# Altium project MainFCC_PCB.PrjPcb (part 1 of 2)
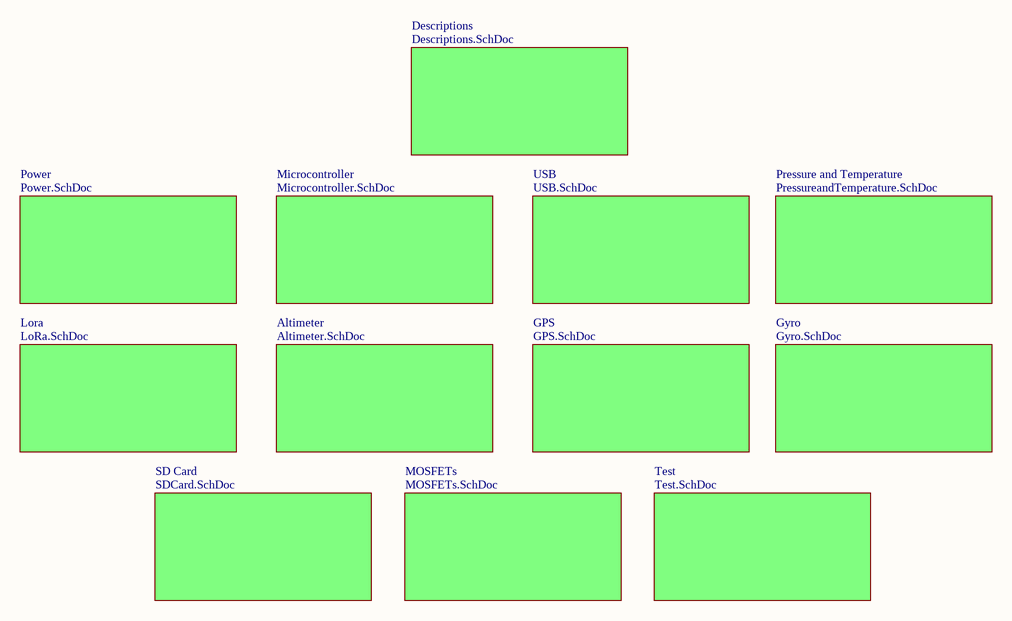
[diagram p0: Main.SchDoc]
Address1: SCÜ; Address2: Merkez     /; Address3: Sivas; Address4: Türkiye; CompanyName: Alpina Rocket; DocumentNumber: 0001; DrawnBy: Av. Des. Tm.; Organization: Alpina Rocket; Revision: v1.0.0
13 sheets, 119 parts. Net scope: flat (ports and power ports of the same name join across sheets).
Board file: MainFCC_PCBBoard.PcbDoc
Sheets:
  Main.SchDoc
    Power = Power.SchDoc
    Microcontroller = Microcontroller.SchDoc
    USB = USB.SchDoc
    Pressure and Temperature = PressureandTemperature.SchDoc
    Gyro = Gyro.SchDoc
    GPS = GPS.SchDoc
    Altimeter = Altimeter.SchDoc
    Lora = LoRa.SchDoc
    Test = Test.SchDoc
    MOSFETs = MOSFETs.SchDoc
    Descriptions = Descriptions.SchDoc
    SD Card = SDCard.SchDoc

## Sheet Main.SchDoc
size A4; SheetNumber: 1; SheetTotal: 13

### Sub-sheets
Altimeter = Altimeter.SchDoc: no entries
Descriptions = Descriptions.SchDoc: no entries
GPS = GPS.SchDoc: no entries
Gyro = Gyro.SchDoc: no entries
Lora = LoRa.SchDoc: no entries
Microcontroller = Microcontroller.SchDoc: no entries
MOSFETs = MOSFETs.SchDoc: no entries
Power = Power.SchDoc: no entries
Pressure and Temperature = PressureandTemperature.SchDoc: no entries
SD Card = SDCard.SchDoc: no entries
Test = Test.SchDoc: no entries
USB = USB.SchDoc: no entries

### Notes on the sheet
- Title:
- Size:
- Date:
- A4
- Number:
- Time:
- Revision:
- Sheet
- of
- Project
- Drawn By :

## Sheet Power.SchDoc: Power Distribution
size A4; ApprovedBy: Ayçin Erbil, Ayşe Hazal Demirci, Büşra Yılmaz, Ekrem Turan Fırat, Fatmanur Özen, Meryem Şen; CheckedBy: Ayçin Erbil, Ayşe Hazal Demirci, Büşra Yılmaz, Ekrem Turan Fırat, Fatmanur Özen, Meryem Şen; Author: Ayçin Erbil, Ayşe Hazal Demirci, Büşra Yılmaz, Ekrem Turan Fırat, Fatmanur Özen, Meryem Şen; CompanyName: Alpina Roket; DrawnBy: Av. Des. Tm.; Engineer: Ayçin Erbil, Ayşe Hazal Demirci, Büşra Yılmaz, Ekrem Turan Fırat, Fatmanur Özen, Meryem Şen; Organization: Alpina Roket; Address1: SCÜ; Address2: Merkez   /; Address3: Sivas; Address4: Türkiye; DocumentNumber: 0001; Revision: v0.0.1; SheetNumber: 3; SheetTotal: 13
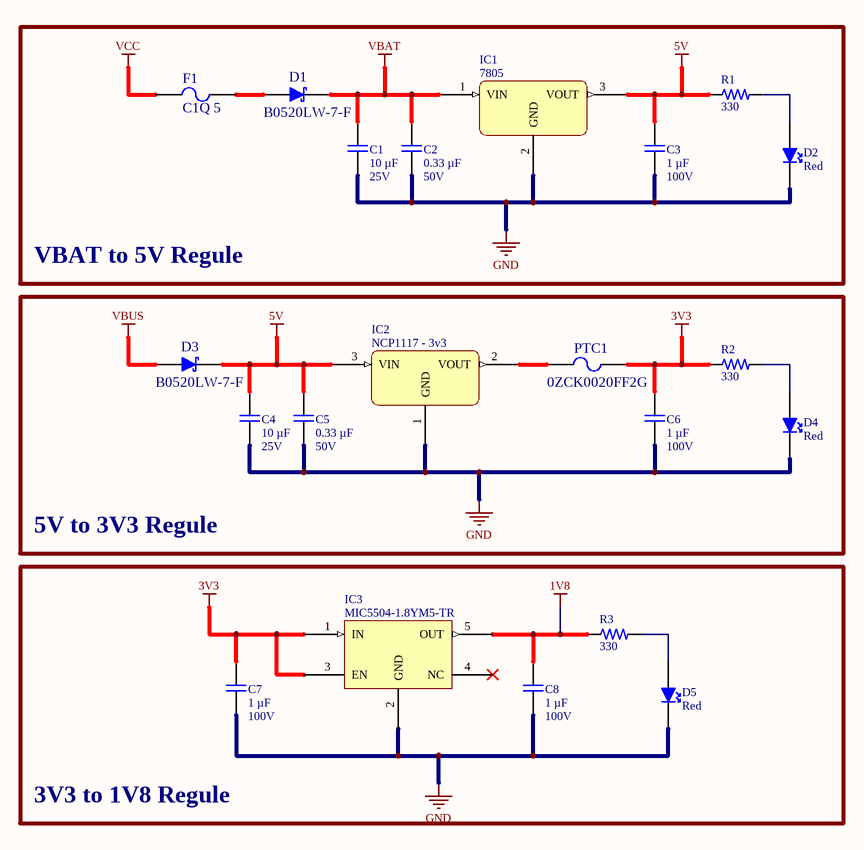
[diagram p1: Power.SchDoc]

### Parts
C1  10 µF  Voltage Rating: 25V  [MergenElektronik_Capacitors_Ceramics_SMDs_0603_L_NS]
C2  0.33 µF  Voltage Rating: 50V  [MergenElektronik_Capacitors_Ceramics_SMDs_0603_L_NS]
C3  1 µF  Voltage Rating: 100V  [MergenElektronik_Capacitors_Ceramics_SMDs_1206_M_NS]
C4  10 µF  Voltage Rating: 25V  [MergenElektronik_Capacitors_Ceramics_SMDs_0603_M_NS]
C5  0.33 µF  Voltage Rating: 50V  [MergenElektronik_Capacitors_Ceramics_SMDs_0603_M_NS]
C6  1 µF  Voltage Rating: 100V  [MergenElektronik_Capacitors_Ceramics_SMDs_1206_M_NS]
C7  1 µF  Voltage Rating: 100V  [MergenElektronik_Capacitors_Ceramics_SMDs_1206_M_NS]
C8  1 µF  Voltage Rating: 100V  [MergenElektronik_Capacitors_Ceramics_SMDs_1206_M_NS]
D1  B0520LW-7-F  [MergenElektronik_Diodes_SchottkyDiodes_SOD-523]
D2  Red  [MergenElektronik_Leds_SMDs_0603_M_NS]
D3  B0520LW-7-F  [MergenElektronik_Diodes_SchottkyDiodes_SOD-523]
D4  Red  [MergenElektronik_Leds_SMDs_0603_M_NS]
D5  Red  [MergenElektronik_Leds_SMDs_0603_M_NS]
F1  C1Q 5  [MergenElektronik_CircuitProtections_Fuses_1206_l]
IC1  7805  [MergenElektronik_Regulators_Linears_DPAK]
IC2  NCP1117 - 3v3  [MergenElektronik_Regulators_Linears_SOT223]
IC3  MIC5504-1.8YM5-TR  [MergenElektronik_Regulators_Linears_SOT-23-5]
PTC1  0ZCK0020FF2G  [MergenElektronik_CircuitProtections_PTCs_0805_M_NS]
R1  330  [MergenElektronik_Resistors_ChipResistors_0603_M_NS]
R2  330  [MergenElektronik_Resistors_ChipResistors_0603_M_NS]
R3  330  [MergenElektronik_Resistors_ChipResistors_0603_M_NS]

### Blocks framed on the sheet
VBAT to 5V Regule: C1-C3 D1 D2 F1 IC1 R1
5V to 3V3 Regule: C4-C6 D3 D4 IC2 PTC1 R2
3V3 to 1V8 Regule: C7 C8 D5 IC3 R3

### Nets
1V8: C8.1 IC3.5(OUT) R3.1
3V3: C6.1 C7.1 IC3.1(IN) IC3.3(EN) PTC1.2 R2.1
5V: C3.1 C4.1 C5.1 D3.2(KATOT) IC1.3(VOUT) IC2.3(VIN) R1.1
GND: C1.2 C2.2 C3.2 C4.2 C5.2 C6.2 C7.2 C8.2 D2.2(KATOT) D4.2(KATOT) D5.2(KATOT) IC1.2(GND) IC2.1(GND) IC3.2(GND)
VBAT: C1.1 C2.1 D1.2(KATOT) IC1.1(VIN)
VBUS: D3.1(ANOT)
VCC: F1.1
NetD1_1: D1.1(ANOT) F1.2
NetD2_1: D2.1(ANOT) R1.2
NetD4_1: D4.1(ANOT) R2.2
NetD5_1: D5.1(ANOT) R3.2
NetIC2_2: IC2.2(VOUT) PTC1.1

Not connected (* = marked no-connect by the designer): IC3 4(NC)*

### Notes on the sheet
- Title:
- Size:
- Date:
- A4
- Number:
- Time:
- Revision:
- Sheet
- of
- Project
- Drawn By :

### Library data of the parts
C1 C4 = MergenElektronik_Capacitors_Ceramic_SMDs_10µF_25V: Mergen Elektronik - Capacitors - Ceramics - SMDs - 0603 - 10 µF - 25V; Manufacturer: Murata Electronics; Manufacturer Number: GRT188R61E106ME13D; Model: Ceramic Capacitors; Tolerance: ±20%; Value: 10 µF; Temperature: -55°C up to +85°C; Digi-Key Number: 490-12323-1-ND; Package: 0603(1608); Farnell Number: 3581819; Mouser Number: 81-GRT188R61E106ME3D; Mounting Type: Surface Mount; Supplier 1: Digi-Key; Supplier 2: Mouser; Supplier Part Number 1: 490-12323-1-ND; Supplier Part Number 2: 81-GRT188R61E106ME3D
C2 C5 = MergenElektronik_Capacitors_Ceramic_SMDs_0.33µF_50V: Mergen Elektronik - Capacitors - Ceramics - SMDs - 0603 - 0.33 µF - 50V; Manufacturer: TDK Corporation; Manufacturer Number: C1608X7R1H334K080AC; Model: Ceramic Capacitors; Tolerance: ±10%; Value: 0.33 µF; Temperature: -55°C up to +125°C; Digi-Key Number: 445-5950-1-ND; Package: 0603(1608); Farnell Number: 2346907; Mouser Number: 810-C1608X7R1H334K; Mounting Type: Surface Mount; Supplier 1: Digi-Key; Supplier 2: Mouser; Supplier Part Number 1: 445-5950-1-ND; Supplier Part Number 2: 810-C1608X7R1H334K
C3 C6-C8 = MergenElektronik_Capacitors_Ceramic_SMDs_1µF_100V: Mergen Elektronik - Capacitors - Ceramics - SMDs - 1206 - 1 µF - 100V; Manufacturer: Samsung Electro-Mechanics; Manufacturer Number: CL31B105KCHNNNE; Model: Ceramic Capacitors; Tolerance: ±10%; Value: 1 µF; Temperature: -55°C up to +125°C; Digi-Key Number: 1276-1838-1-ND; Package: 1206(3216 Metric); Mouser Number: 187-CL31B105KCHNNNE; Mounting Type: Surface Mount; Özdisan Number: CL31B105KCHNNNE; Supplier 1: Digikey; Supplier 2: Mouser; Supplier Part Number 1: 1276-1838-1-ND; Supplier Part Number 2: 187-CL31B105KCHNNNE
D1 D3 = MergenElektronik_Diodes_SchottkyDiodes_B0520LW-7-F: Mergen Elektronik - Diodes - Schottky Diodes - B0520LW-7-F; Manufacturer: Diodes Incorporated; Breakdown Voltage: 20V; Current Rating: 500mA; Forward Voltage: 385 mV @ 500mA; Digi-Key Number: B0520LW-FDITR-ND; Manufacturer Number: B0520LW-7-F; Model: Schottky Diodes; Mounting Type: Surface Mount; Package: SOD-123; Temperature: -65°C up to +125°C; Value: B0520LW-7-F; Mouser Number: 621-B0520LW-F; Farnell Number: 1773476; Supplier 1: Digikey; Supplier 2: Mouser; Supplier Part Number 2: 621-B0520LW-F; Supplier Part Number 1: B0520LW-FDITR-ND
D2 D4 D5 = MergenElektronik_LEDs_SMDs_Red_0603: Mergen Elektronik - Leds - SMDs - Red - 0603; Manufacturer: Würth Elektronik; Manufacturer Number: 150060RS75000; Model: SMD Leds; Voltage Rating: 2V; Value: Red; Temperature: -45°C up to +85°C; Digi-Key Number: 732-4978-1-ND; Package: 0603(1608); Farnell Number: 2322071; Mouser Number: 710-150060RS75000; Mounting Type: Surface Mount; Color: Red; Özdisan Number: 150060RS75000; Supplier 1: Digi-Key; Supplier 2: Mouser; Supplier Part Number 1: 732-4978-1-ND; Supplier Part Number 2: 710-150060RS75000
F1 = MergenElektronik_CircuitProtections_Fuses_0C1Q 5: Mergen Elektronik - Circuit Protections - Fuses - 0C1Q 5; Manufacturer: Bel Fuse Inc.; Model: Fuse; Voltage Rating: 125V @ AC - 63V @ DC; Current Rating: 5 A; Breaking Capacity: 100A @ AC,- 50A @ DC; Melting I²t: 0.075; Response Time: Fast Blow; Digi-Key Number: 5923-C1Q5TR-ND; Manufacturer Number: C1Q 5; Mounting Type: Surface Mount; Mouser Number: 530-0ZCK0020FF2G; Package: 1206(3216); Temperature: -40°C up to 85°C; Value: C1Q 5; Supplier 1: Digi-Key; Supplier Part Number 1: 507-1811-6-ND
IC1 = MergenElektronik_Regulators_Linears_MC7805BDTG: Mergen Elektronik - Regulators - Linears - MC7805BDTG; Manufacturer: onsemi; Current Rating: 1A; Model: Linear; Output Voltage: 5V; Voltage Rating: 7VDC up to 36V; Temperature: -40°C up to +125°C; Value: MC7805BDTG; Mounting Type: Surface Mount; Digi-Key Number: MC7805BDTGOS-ND; Manufacturer Number: MC7805BDTG; Mouser Number: 863-MC7805BDTG; Özdisan Number: MC7805BDTG; Farnell Number: 1652336; Package: DPAK; Supplier 1: Digi-Key; Supplier 2: Mouser; Supplier Part Number 1: MC7805BDTGOS-ND; Supplier Part Number 2: 863-MC7805BDTG
IC2 = MergenElektronik_Regulators_Linears_NCP1117ST33T3G: Mergen Elektronik - Regulators - Linears - NCP1117ST33T3G; Manufacturer: onsemi; Current Rating: 1A; Model: Linear; Output Voltage: 3.3V; Voltage Rating: 4.75VDC up to 10V; Temperature: 0°C up to +125°C; Value: NCP1117ST33T3G; Mounting Type: Surface Mount; Digi-Key Number: NCP1117ST33T3GOSCT-ND; Manufacturer Number: NCP1117ST33T3G; Mouser Number: 863-NCP1117ST33T3G; Özdisan Number: NCP1117ST33T3G; Supplier 1: Digi-Key; Supplier 2: Mouser; Supplier Part Number 1: NCP1117ST33T3GOSCT-ND; Supplier Part Number 2: 863-NCP1117ST33T3G; Package: SOT-223
IC3 = MergenElektronik_Regulators_Linears_MIC5504-1.8YM5-TR: Mergen Elektronik - Regulators - Linears - MIC5504-1.8YM5-TR; Manufacturer: Microchip Technology; Current Rating: 300mA; Model: Linear; Output Voltage: 1.8V(Fixed); Voltage Rating: 2.2V up to 5.5V; Temperature: -40°C up to +125°C; Value: MIC5504-1.8YM5-TR; Mounting Type: Surface Mount; Digi-Key Number: 576-4879-2-ND; Manufacturer Number: MIC5504-1.8YM5-TR; Mouser Number: 998-MIC5504-1.8YM5TR; Farnell Number: 2809977; Package: SOT-23-5; Supplier 1: Digikey; Supplier 2: Mouser; Supplier Part Number 1: 576-4879-2-ND; Supplier Part Number 2: 998-MIC5504-1.8YM5TR
PTC1 = MergenElektronik_CircuitProtections_PTCs_0ZCK0020FF2G: Mergen Elektronik - Circuit Protections - PTCs - 0ZCK0020FF2G; Manufacturer: Bel Fuse Inc.; Model: PTC Fuse; Current Rating: 500 mA; Voltage Rating: 9V; Current - Max: 100A; Current - Hold: 200 mA; Digi-Key Number: 507-1811-1-ND; Manufacturer Number: 0ZCK0020FF2G; Mounting Type: Surface Mount; Mouser Number: 530-0ZCK0020FF2G; Package: 0805(2012); Temperature: -40°C up to 85°C; Value: 0ZCK0020FF2G; Supplier 1: Digi-Key; Supplier Part Number 1: 507-1811-6-ND; Current - Trip: 500 mA; Supplier 2: Mouser; Supplier Part Number 2: 530-0ZCK0020FF2G
R1-R3 = MergenElektronik_Resistors_ChipResistors_0603_330R: Mergen Elektronik - Resistors - Chip Resistors - 0603 - 330R; Manufacturer: Stackpole Electronics Inc; Manufacturer Number: RMCF0603JT330R; Value: Chip Resistor - 0603 - 330R; Power: 1/10W; Tolerance: ±5%; Package: 0603(1608); Temperature: -55°C up to +155°C - X8R; Model: Chip Resistor; Digi-Key Number: RMCF0603JT330RCT-ND; Mounting Type: Surface Mount; Supplier 1: Digi-Key; Supplier Part Number 1: RMCF0603JT330RCT-ND

## Sheet Microcontroller.SchDoc: Microcontroller
size A4; SheetNumber: 4; SheetTotal: 13
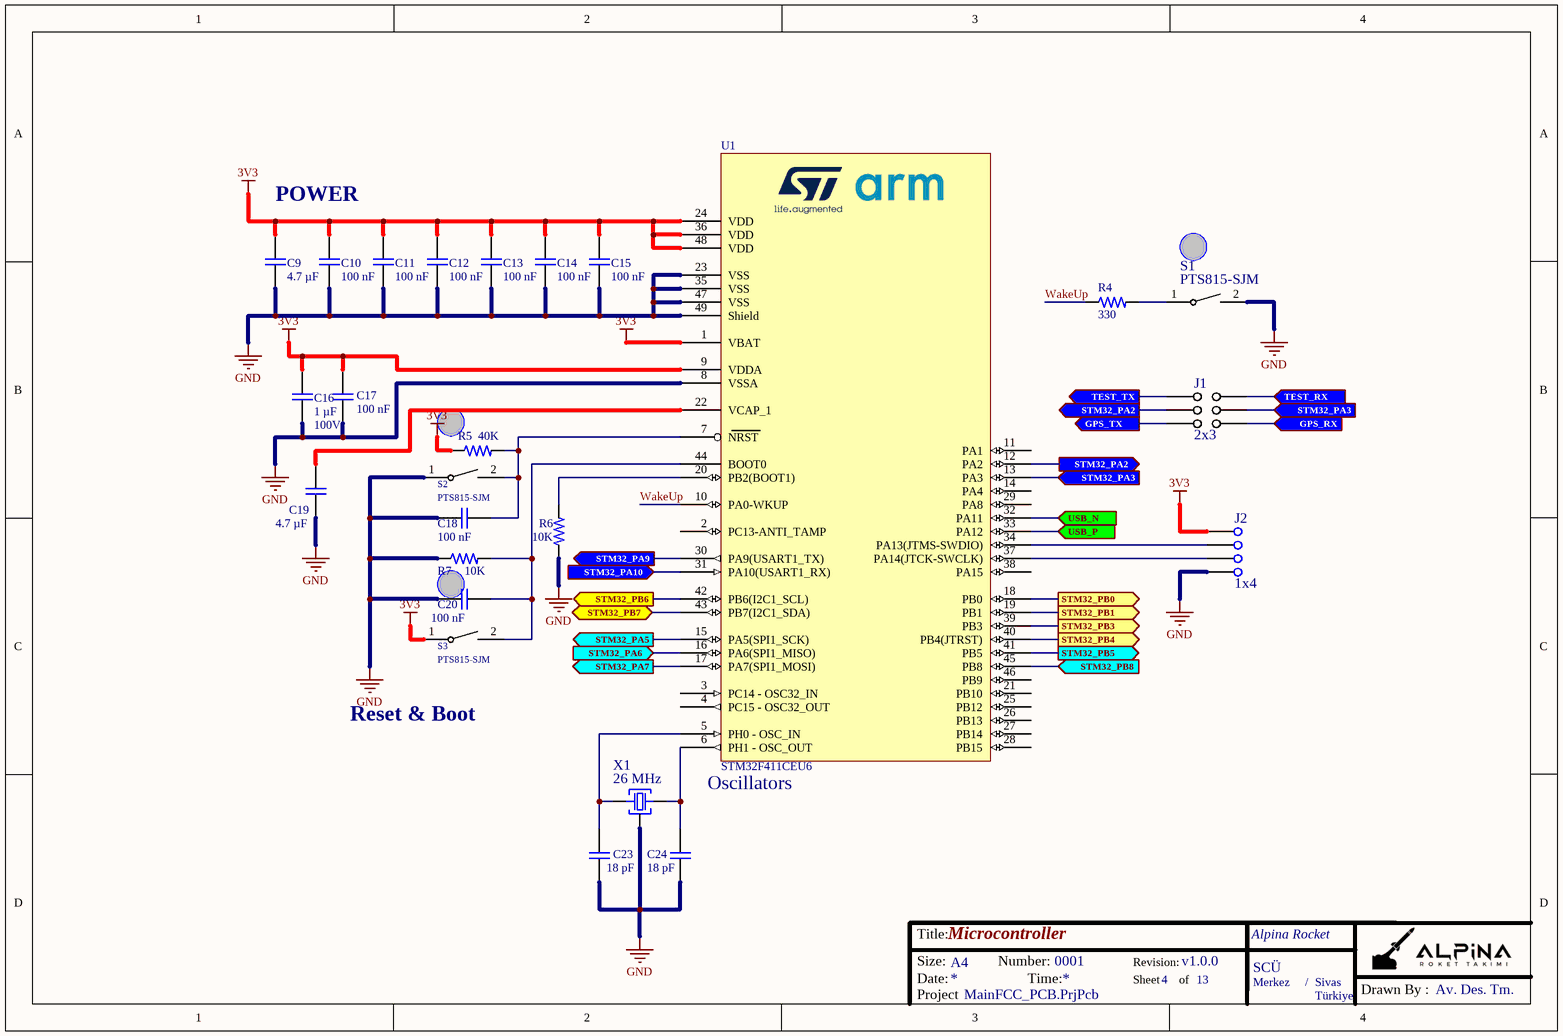
[diagram p2: Microcontroller.SchDoc]

### Parts
C9  4.7 µF  [MergenElektronik_Capacitors_Ceramics_SMDs_0603_M_NS]
C10  100 nF  [MergenElektronik_Capacitors_Ceramics_SMDs_0603_M_NS]
C11  100 nF  [MergenElektronik_Capacitors_Ceramics_SMDs_0603_M_NS]
C12  100 nF  [MergenElektronik_Capacitors_Ceramics_SMDs_0603_M_NS]
C13  100 nF  [MergenElektronik_Capacitors_Ceramics_SMDs_0603_M_NS]
C14  100 nF  [MergenElektronik_Capacitors_Ceramics_SMDs_0603_M_NS]
C15  100 nF  [MergenElektronik_Capacitors_Ceramics_SMDs_0603_M_NS]
C16  1 µF  Voltage Rating: 100V  [MergenElektronik_Capacitors_Ceramics_SMDs_1206_M_NS]
C17  100 nF  [MergenElektronik_Capacitors_Ceramics_SMDs_0603_M_NS]
C18  100 nF  [MergenElektronik_Capacitors_Ceramics_SMDs_0603_M_NS]
C19  4.7 µF  [MergenElektronik_Capacitors_Ceramics_SMDs_0603_M_NS]
C20  100 nF  [MergenElektronik_Capacitors_Ceramics_SMDs_0603_M_NS]
C23  18 pF  [MergenElektronik_Capacitors_Ceramics_SMDs_0603_M_NS]
C24  18 pF  [MergenElektronik_Capacitors_Ceramics_SMDs_0603_M_NS]
J1  2x3  [MergenElektronik_Connectors_Headers_2x3_Male]
J2  1x4  [MergenElektronik_Connectors_Headers_1x4_Male]
R4  330  [MergenElektronik_Resistors_ChipResistors_0603_M_NS]
R5  40K  [MergenElektronik_Resistors_ChipResistors_0603_M_NS]
R6  10K  [MergenElektronik_Resistors_ChipResistors_0603_M_NS]
R7  10K  [MergenElektronik_Resistors_ChipResistors_0603_M_NS]
S1  PTS815-SJM  [MergenElektronik_Switches_TactileSwitches_PTS815]
S2  PTS815-SJM  [MergenElektronik_Switches_TactileSwitches_PTS815]
S3  PTS815-SJM  [MergenElektronik_Switches_TactileSwitches_PTS815]
U1  STM32F411CEU6  [MergenElektronik_Microcontrollers_STMicroelectronics_UFQFPN-48]
X1  26 MHz  [MergenElektronik_Oscillators_Crystals_4-SMD]

### Ports
GPS_RX (in, see GPS[3B]), GPS_TX (out, see GPS[3B]), STM32_PA2 (out, see Microcontroller[3B]), STM32_PA3 (in, see Microcontroller[3B]), STM32_PA3 (in, see Microcontroller[4B]), STM32_PA5 (out, see SDCard[2C]), STM32_PA6 (in, see SDCard[2C]), STM32_PA7 (out, see SDCard[2C]), STM32_PA9 (out, see LoRa[3C]), STM32_PA10 (in, see LoRa[3B]), STM32_PB0 (out, see LoRa[3C]), STM32_PB1 (out, see LoRa[3C]), STM32_PB3 (out, see MOSFETs[2B]), STM32_PB4 (out, see MOSFETs[3B]), STM32_PB5 (out, see SDCard[2C]), STM32_PB6 (out, see Altimeter[3B], GPS[3B], Gyro[4B], PressureandTemperature[3B]), STM32_PB7 (bidir, see Altimeter[3B], GPS[3B], Gyro[4C], PressureandTemperature[3B]), STM32_PB8 (in, see SDCard[2C]), TEST_RX (in, see Test[3C]), TEST_TX (out, see Test[3C]), USB_N (in, see USB[4B]), USB_P (in, see USB[4B])

### Nets
3V3: C9.1 C10.1 C11.1 C12.1 C13.1 C14.1 C15.1 C16.1 C17.1 J2.4 R5.1 S3.1 U1.1(VBAT) U1.9(VDDA) U1.24(VDD) U1.36(VDD) U1.48(VDD)
GND: C9.2 C10.2 C11.2 C12.2 C13.2 C14.2 C15.2 C16.2 C17.2 C18.2 C19.2 C20.2 C23.2 C24.2 J2.1 R6.1 R7.1 S1.2 S2.1 U1.8(VSSA) U1.23(VSS) U1.35(VSS) U1.47(VSS) U1.49(Shield) X1.3
USB_N: U1.32(PA11) ; port USB_N
USB_P: U1.33(PA12) ; port USB_P
WakeUp: R4.1 U1.10(PA0-WKUP)
NetC18_1: C18.1 R5.2 S2.2 U1.7(NRST)
NetC19_1: C19.1 U1.22(VCAP_1)
NetC20_1: C20.1 R7.2 S3.2 U1.44(BOOT0)
NetC23_1: C23.1 U1.5(PH0_-_OSC_IN) X1.1
NetC24_1: C24.1 U1.6(PH1_-_OSC_OUT) X1.2
NetJ1_1: J1.1 ; port GPS_TX
NetJ1_2: J1.2 U1.12(PA2) ; port STM32_PA2
NetJ1_3: J1.3 ; port TEST_TX
NetJ1_4: J1.4 ; port GPS_RX
NetJ1_5: J1.5 U1.13(PA3) ; port STM32_PA3
NetJ1_6: J1.6 ; port TEST_RX
NetJ2_2: J2.2 U1.37(PA14(JTCK-SWCLK))
NetJ2_3: J2.3 U1.34(PA13(JTMS-SWDIO))
NetJ5_CD: U1.45(PB8) ; port STM32_PB8
NetJ5_P2: U1.41(PB5) ; port STM32_PB5
NetJ5_P3: U1.17(PA7(SPI1_MOSI)) ; port STM32_PA7
NetJ5_P5: U1.15(PA5(SPI1_SCK)) ; port STM32_PA5
NetJ5_P7: U1.16(PA6(SPI1_MISO)) ; port STM32_PA6
NetR4_2: R4.2 S1.1
NetR6_2: R6.2 U1.20(PB2(BOOT1))
NetR14_1: U1.42(PB6(I2C1_SCL)) ; port STM32_PB6
NetR15_1: U1.43(PB7(I2C1_SDA)) ; port STM32_PB7
NetR31_1: U1.39(PB3) ; port STM32_PB3
NetR32_1: U1.40(PB4(JTRST)) ; port STM32_PB4
NetU1_18: U1.18(PB0) ; port STM32_PB0
NetU1_19: U1.19(PB1) ; port STM32_PB1
NetU1_30: U1.30(PA9(USART1_TX)) ; port STM32_PA9
NetU1_31: U1.31(PA10(USART1_RX)) ; port STM32_PA10

Not connected (* = marked no-connect by the designer): U1 2(PC13-ANTI_TAMP) 3(PC14_-_OSC32_IN) 4(PC15_-_OSC32_OUT) 11(PA1) 14(PA4) 21(PB10) 25(PB12) 26(PB13) 27(PB14) 28(PB15) 29(PA8) 38(PA15) 46(PB9)

### Notes on the sheet
- POWER
- Reset & Boot
- (near U1) Oscillators
- Title:
- Size:
- Date:
- A4
- Number:
- Time:
- Revision:
- Sheet
- of
- Project
- Drawn By :

### Library data of the parts
C9 C19 = MergenElektronik_Capacitors_Ceramic_SMDs_4.7µF_16V: Mergen Elektronik - Capacitors - Ceramics - SMDs - 0603 - 4.7 µF - 16V; Manufacturer: Samsung Electro-Mechanics; Manufacturer Number: CL10A475KO8NNNC; Model: Ceramic Capacitors; Tolerance: ±10%; Value: 4.7 µF; Temperature: -55°C up to +85°C; Digi-Key Number: 1276-1784-2-ND; Package: 0603(1608); Mouser Number: 187-CL10A475KO8NNNC; Mounting Type: Surface Mount; Supplier 1: Digi-Key; Supplier 2: Mouser; Supplier Part Number 1: 1276-1784-2-ND; Supplier Part Number 2: 187-CL10A475KO8NNNC; Özdisan Number: CL10A475KO8NNNC; Farnell Number: 3013397; Voltage Rating: 16V
C10-C15 C17 C18 C20 = MergenElektronik_Capacitors_Ceramic_SMDs_100nF_100V: Mergen Elektronik - Capacitors - Ceramics - SMDs - 0603 - 100 nF - 100V; Manufacturer: Samsung Electro-Mechanics; Manufacturer Number: CL10B104KC8NNNC; Model: Ceramic Capacitors; Tolerance: ±10%; Value: 100 nF; Temperature: -55°C up to +125°C; Digi-Key Number: 1276-6807-1-ND; Package: 0603(1608 Metric); Mouser Number: 187-CL10B104KC8NNNC; Mounting Type: Surface Mount; Farnell Number: 3013412; Özdisan Number: CL10B104KC8NNNC; Supplier 1: Digikey; Supplier 2: Mouser; Supplier Part Number 1: 1276-6807-1-ND; Supplier Part Number 2: 187-CL10B104KC8NNNC; Voltage Rating: 100V
C16 = MergenElektronik_Capacitors_Ceramic_SMDs_1µF_100V: as C3 on sheet Power; Value: 1 µF; Temperature: -55°C up to +125°C; Digi-Key Number: 1276-1838-1-ND; Package: 1206(3216 Metric); Mouser Number: 187-CL31B105KCHNNNE; Mounting Type: Surface Mount; Özdisan Number: CL31B105KCHNNNE; Supplier 1: Digikey; Supplier 2: Mouser; Supplier Part Number 1: 1276-1838-1-ND; Supplier Part Number 2: 187-CL31B105KCHNNNE
C23 C24 = MergenElektronik_Capacitors_Ceramic_SMDs_18pF_50V: Mergen Elektronik - Capacitors - Ceramics - SMDs - 0603 - 18 pF - 50V; Manufacturer: YAGEO; Manufacturer Number: CC0603JRNPO9BN180; Model: Ceramic Capacitors; Tolerance: ±5%; Value: 18 pF; Temperature: -55°C up to +125°C; Digi-Key Number: 311-1061-1-ND; Package: 0603(1608); Farnell Number: 2408496; Mouser Number: 603-CC603JRNPO9BN180; Mounting Type: Surface Mount; Supplier 1: Mouser; Supplier 2: Digi-Key; Supplier Part Number 1: 603-CC603JRNPO9BN180; Supplier Part Number 2: 311-1061-6-ND; Voltage Rating: 50V
J1 = MergenElektronik_Connectors_Headers_2x3_Male: Mergen Elektronik - Connectors - Headers - 2x3 Male
J2 = MergenElektronik_Connectors_Headers_1x4_Male: Mergen Elektronik - Connectors - Headers - 1x4 Male
R4 = MergenElektronik_Resistors_ChipResistors_0603_330R: as R1 on sheet Power; Package: 0603(1608); Temperature: -55°C up to +155°C - X8R; Model: Chip Resistor; Digi-Key Number: RMCF0603JT330RCT-ND; Mounting Type: Surface Mount; Supplier 1: Digi-Key; Supplier Part Number 1: RMCF0603JT330RCT-ND
R5 = MergenElektronik_Resistors_ChipResistors_0603_40K: Mergen Elektronik - Resistors - Chip Resistors - 0603 - 40K; Manufacturer: YAGEO; Manufacturer Number: RT0603BRD0740KL; Value: Chip Resistor - 0603 - 40K; Power: 1/10W; Tolerance: ±0.1%; Package: 0603(1608); Temperature: -55°C up to +155°C - X8R; Model: Chip Resistor; Digi-Key Number: 13-RT0603BRD0740KLTR-ND; Mounting Type: Surface Mount; Mouser Number: 603-RT0603BRD0740KL; Supplier 1: Digikey; Supplier 2: Mouser; Supplier Part Number 1: 13-RT0603BRD0740KLDKR-ND; Supplier Part Number 2: 603-RT0603BRD0740KL
R6 R7 = MergenElektronik_Resistors_ChipResistors_0603_10K: Mergen Elektronik - Resistors - Chip Resistors - 0603 - 10K; Manufacturer: Stackpole Electronics Inc; Manufacturer Number: RMCF0603JT10K0; Value: Chip Resistor - 0603 - 10K; Power: 1/10W; Tolerance: ±5%; Package: 0603(1608); Temperature: -55°C up to +155°C - X8R; Model: Chip Resistor; Digi-Key Number: RMCF0603JT10K0CT-ND; Mounting Type: Surface Mount; Supplier 1: Digi-Key; Supplier Part Number 1: RMCF0603JT10K0-ND
S1-S3 = MergenElektronik_Switches_TactileSwitches_PTS815-SJM: Mergen Elektronik - Switches - Tactile  Switches; Manufacturer Number: PTS815 SJM 250 SMTR LFS; Manufacturer: C&K; Current Rating: 50mA; Voltage Rating: 12VDC; Digi-Key Number: CKN12215-1-ND; Model: Tactile Switches; Mounting Type: Surface Mount; Package: PTS815; Temperature: -20°C up to +70°C; Value: PTS815-SJM; Mouser Number: 611-PTS815SJM250SMTR; Farnell Number: 3780619; Supplier 1: Mouser; Supplier 2: Digi-Key; Supplier Part Number 1: 611-PTS815SJM250SMTR; Supplier Part Number 2: CKN12215-6-ND
U1 = MergenElektronik_Microcontrollers_STMicroelectronics_STM32F411CEU6: Mergen Elektronik - Microcontrollers - STMicroelectronics - STM32F411CEU6; Model: ARM® Cortex®-M4 Microcontroller; Operating Supply Voltage: 1.7V up to 3.6V; Number of I/O: 36; Speed: 100MHz with PLL; Core Size: 32-Bit; Memory Size: 512kB; Ram Size: 128K x 8; Digi-Key Number: 497-14907-ND; Manufacturer: STMicroelectronics; Manufacturer Number: STM32F411CEU6; Mounting Type: Surface Mount; Mouser Number: 511-STM32F411CEU6; Package: UFQFPN-48; Temperature: -40°C up to 85°C (TA); Value: STM32F411CEU6; Farnell Number: 3365489; Supplier 1: Digikey; Supplier 2: Mouser; Supplier Part Number 1: 497-14907-ND; Supplier Part Number 2: 511-STM32F411CEU6
X1 = MergenElektronik_Oscillators_Crystals_4_SMD_26MHz: Mergen Elektronik - Oscilators - Crystals - 4-SMD - 26 MHz; Manufacturer: TXC CORPORATION; Manufacturer Number: 7M-26.000MAAJ-T; Model: Crystal Oscilator; Load Capacitance: 18 pF; Digi-Key Number: 887-1133-2-ND; Mounting Type: Surface Mount; Frequency: 26 MHz; Package: 4-SMD; Temperature: -20°C up to 70°C; Value: 26 MHz; Supplier 1: Digi-Key; Supplier Part Number 1: 2151-RH100-12.000-18-2030-TRCT-ND; Supplier Part Number 2: 717-7M-26.000MAAJ-T; Supplier 2: Mouser; Farnell Number: 1842069; Mouser Number: 717-7M-26.000MAAJ-T

## Sheet USB.SchDoc: USB
size A4; SheetNumber: 5; SheetTotal: 13
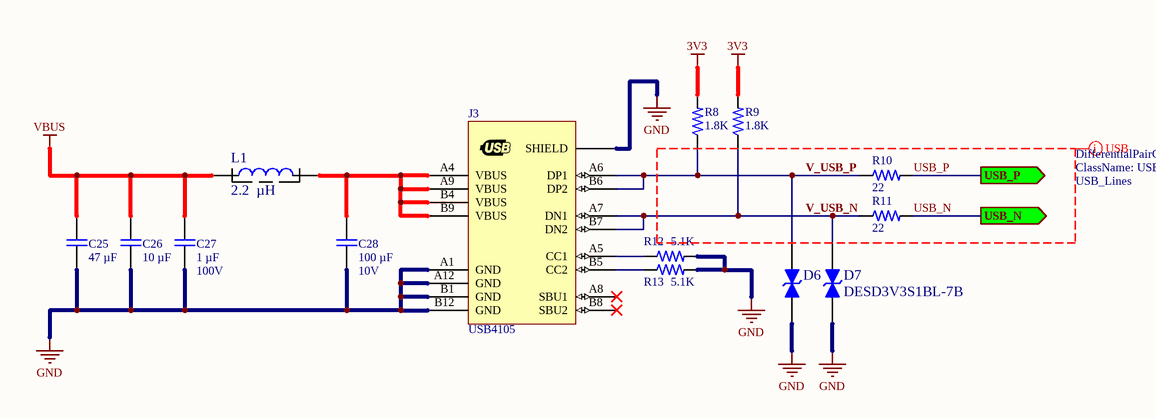
[diagram p3: USB.SchDoc]

### Parts
C25  47 µF  [MergenElektronik_Capacitors_Ceramics_SMDs_1206_M_NS]
C26  10 µF  [MergenElektronik_Capacitors_Ceramics_SMDs_0603_M_NS]
C27  1 µF  Voltage Rating: 100V  [MergenElektronik_Capacitors_Ceramics_SMDs_1206_M_NS]
C28  100 µF  Voltage Rating: 10V  [MergenElektronik_Capacitors_Ceramics_SMDs_1210_M_NS]
D6  DESD3V3S1BL-7B  [MergenElektronik_Diodes_TVSDiodes_0402_L]  (value not drawn)
D7  DESD3V3S1BL-7B  [MergenElektronik_Diodes_TVSDiodes_0402_L]
J3  USB4105  [MergenElektronik_Connectors_USB_USB4105]
L1  2.2  µH  [MergenElektronik_Inductors_PowerInductors_SMDs_1008_M_NS]
R8  1.8K  [MergenElektronik_Resistors_ChipResistors_0603_M_NS]
R9  1.8K  [MergenElektronik_Resistors_ChipResistors_0603_M_NS]
R10  22  [MergenElektronik_Resistors_ChipResistors_0603_M_NS]
R11  22  [MergenElektronik_Resistors_ChipResistors_0603_M_NS]
R12  5.1K  [MergenElektronik_Resistors_ChipResistors_0603_M_NS]
R13  5.1K  [MergenElektronik_Resistors_ChipResistors_0603_M_NS]

### Ports
USB_N (out, see Microcontroller[3C]), USB_P (out, see Microcontroller[3C])

### Nets
3V3: R8.2 R9.2
GND: C25.2 C26.2 C27.2 C28.2 D6.1(ANOT) D7.1(ANOT) J3.A1(GND) J3.A12(GND) J3.B1(GND) J3.B12(GND) J3.SHIELD R12.2 R13.2
VBUS: C25.1 C26.1 C27.1 L1.1
USB_N: R11.2 ; port USB_N
USB_P: R10.2 ; port USB_P
V_USB_N: D7.2(KATOT) J3.A7(DN1) J3.B7(DN2) R9.1 R11.1
V_USB_P: D6.2(KATOT) J3.A6(DP1) J3.B6(DP2) R8.1 R10.1
NetC28_1: C28.1 J3.A4(VBUS) J3.A9(VBUS) J3.B4(VBUS) J3.B9(VBUS) L1.2
NetJ3_A5: J3.A5(CC1) R12.1
NetJ3_B5: J3.B5(CC2) R13.1

Not connected (* = marked no-connect by the designer): J3 A8(SBU1)* B8(SBU2)*

### Layout directives
differential pair; differential pair class USB_Lines; net class USB; differential pair class USB_Lines: USB_N, USB_P, V_USB_N, V_USB_P

### Notes on the sheet
- Title:
- Size:
- Date:
- A4
- Number:
- Time:
- Revision:
- Sheet
- of
- Project
- Drawn By :

### Library data of the parts
C25 = MergenElektronik_Capacitors_Ceramic_SMDs_47µF_25V: Mergen Elektronik - Capacitors - Ceramics - SMDs - 1206 - 47 µF - 25V; Manufacturer: TDK Corporation; Manufacturer Number: C3216X5R1E476M160AC; Model: Ceramic Capacitors; Tolerance: ±20%; Value: 47 µF; Temperature: -55°C up to +85°C; Digi-Key Number: 445-8047-2-ND; Package: 1206(3216); Mouser Number: 810-C3216X5R1E476M; Mounting Type: Surface Mount; Supplier 1: Digi-Key; Supplier 2: Mouser; Supplier Part Number 1: 445-8047-2-ND; Supplier Part Number 2: 810-C3216X5R1E476M; Özdisan Number: C3216X5R1E476M160AC; Farnell Number: 2525172; Voltage Rating: 25V
C26 = MergenElektronik_Capacitors_Ceramic_SMDs_10µF_25V: as C1 on sheet Power; Value: 10 µF; Temperature: -55°C up to +85°C; Digi-Key Number: 490-12323-1-ND; Package: 0603(1608); Farnell Number: 3581819; Mouser Number: 81-GRT188R61E106ME3D; Mounting Type: Surface Mount; Supplier 1: Digi-Key; Supplier 2: Mouser; Supplier Part Number 1: 490-12323-1-ND; Supplier Part Number 2: 81-GRT188R61E106ME3D; Voltage Rating: 25V
C27 = MergenElektronik_Capacitors_Ceramic_SMDs_1µF_100V: as C3 on sheet Power; Value: 1 µF; Temperature: -55°C up to +125°C; Digi-Key Number: 1276-1838-1-ND; Package: 1206(3216 Metric); Mouser Number: 187-CL31B105KCHNNNE; Mounting Type: Surface Mount; Özdisan Number: CL31B105KCHNNNE; Supplier 1: Digikey; Supplier 2: Mouser; Supplier Part Number 1: 1276-1838-1-ND; Supplier Part Number 2: 187-CL31B105KCHNNNE
C28 = MergenElektronik_Capacitors_Ceramic_SMDs_100µF_10V: Mergen Elektronik - Capacitors - Ceramics - SMDs - 1210 - 100 µF - 10V; Manufacturer: Samsung Electro-Mechanics; Manufacturer Number: CL32A107MPVNNNE; Model: Ceramic Capacitors; Tolerance: ±20%; Özdisan Number: CL10B104KO8NNNC; Value: 100 µF; Temperature: -55°C up to +85°C; Digi-Key Number: 1276-3364-1-ND; Package: 1210(3225 Metric); Mouser Number: 187-CL32A107MPVNNNE; Mounting Type: Surface Mount; Farnell Number: 1838744; Supplier 1: Mouser; Supplier 2: Digi-Key; Supplier Part Number 1: 187-CL10B104KO8NNNC; Supplier Part Number 2: 1276-1005-6-ND
D6 D7 = MergenElektronik_Diodes_TVSDiodes_DESD3V3S1BL-7B: Mergen Elektronik - Diodes - TVS Diodes - DESD3V3S1BL-7B; Manufacturer: Diodes Incorporated; Breakdown Voltage: 3.8V; Current - Peak Pulse: 5A(8/20µs); Voltage Reverse Standoff: 3.3V(Max); Capacitance @ Frequency: 10pF @ 1MHz; Voltae Clamping: 7V; Digi-Key Number: DESD3V3S1BL-7BDITR-ND; Manufacturer Number: DESD3V3S1BL-7B; Model: TVS Diodes; Mounting Type: Surface Mount; Package: 0402 (1006 Metric); Temperature: -65°C up to +150°C; Value: DESD3V3S1BL-7B; Mouser Number: 621-DESD3V3S1BL-7B; Farnell Number: 3127287; Supplier 1: Digikey; Supplier 2: Mouser; Supplier Part Number 2: DESD3V3S1BL-7BDITR-ND; Supplier Part Number 1: 621-DESD3V3S1BL-7B
J3 = MergenElektronik_Connectors_USB_USB4105: Mergen Elektronik - Connectors - USB Connectors - USB4105; Manufacturer: GCT; Manufacturer Number: USB4105-GF-A; Model: Type - C / USB 2.0; Current Rating: 0.25A, 1.25A, 5A, 6.25A; Voltage Rating: 20VDC; Value: USB4105; Mounting Type: THT - SMD R/A; Temperature: -40°C up to 85°C; Digi-Key Number: 2073-USB4105-GF-ACT-ND; Mouser Number: 640-USB4105-GF-A; Farnell Number: 3588205; Özdisan Number: USB4105-GF-A; Supplier 1: Digi-Key; Supplier Part Number 1: 2073-USB4105-GF-ADKR-ND; Supplier 2: Mouser; Supplier Part Number 2: 640-USB4105-GF-A; Package: USB4105
L1 = MergenElektronik_Inductors_PowerInductors_SMDs_1008_2.2µH-2A: Mergen Elektronik - Inductors - Power Inductors - SMDs - 1008 - 2.2 µh - 2A; Manufacturer: Samsung Electro-Mechanics; Manufacturer Number: CIGT252008LM2R2MNE; Digi-Key Number: 1276-6925-1-ND; Model: Power Inductor; Mounting Type: Surface Mount; Package: 1008 (2520 Metric); Temperature: -40°C up to  125°C; Value: 2.2  µH; Current Rating: 2A; Mouser Number: 187-CIGT252008LM2R2M; Supplier 1: Digi-Key; Supplier 2: Mouser; Supplier Part Number 1: 1276-6925-6-ND; Supplier Part Number 2: 187-CIGT252008LM2R2M
R8 R9 = MergenElektronik_Resistors_ChipResistors_0603_1.8K: Mergen Elektronik - Resistors - Chip Resistors - 0603 - 1.8K; Manufacturer: Stackpole Electronics Inc; Manufacturer Number: RMCF0603JT1K80; Value: Chip Resistor - 0603 - 1.8K; Power: 1/10W; Tolerance: ±5%; Package: 0603(1608); Temperature: -55°C up to +155°C - X8R; Model: Chip Resistor; Digi-Key Number: RMCF0603JT1K80TR-ND; Mounting Type: Surface Mount; Mouser Number: 708-RMCF0603JT1K80; Supplier 1: Digikey; Supplier 2: Mouser; Supplier Part Number 1: RMCF0603JT1K80TR-ND; Supplier Part Number 2: 708-RMCF0603JT1K80
R10 R11 = MergenElektronik_Resistors_ChipResistors_0603_22: Mergen Elektronik - Resistors - Chip Resistors - 0603 - 22; Manufacturer: TE Connectivity Passive Product; Manufacturer Number: CRGCQ0603J22R; Value: Chip Resistor - 0603 - 22; Power: 1/10W; Tolerance: ±5%; Özdisan Number: RMCF0603ZT0R00; Package: 0603(1608); Temperature: -55°C up to +155°C - X8R; Model: Chip Resistor; Digi-Key Number: A130081CT-ND; Mounting Type: Surface Mount; Mouser Number: 279-CRGCQ0603J22R; Farnell Number: 2861854; Supplier 1: Digi-Key; Supplier 2: Mouser; Supplier Part Number 1: A130081CT-ND; Supplier Part Number 2: 279-CRGCQ0603J22R
R12 R13 = MergenElektronik_Resistors_ChipResistors_0603_5.1K: Mergen Elektronik - Resistors - Chip Resistors - 0603 - 5.1K; Manufacturer: Stackpole Electronics Inc; Manufacturer Number: RMCF0603JT5K10; Value: Chip Resistor - 0603 - 5.1K; Power: 1/10W; Tolerance: ±5%; Package: 0603(1608); Temperature: -55°C up to +155°C - X8R; Model: Chip Resistor; Digi-Key Number: RMCF0603JT5K10CT-ND; Mounting Type: Surface Mount; Mouser Number: 708-RMCF0603JT5K10; Supplier 1: Digi-Key; Supplier Part Number 1: RMCF0603JT5K10DKR-ND

## Sheet PressureandTemperature.SchDoc: Pressure and Temperature
size A4; SheetNumber: 8; SheetTotal: 13
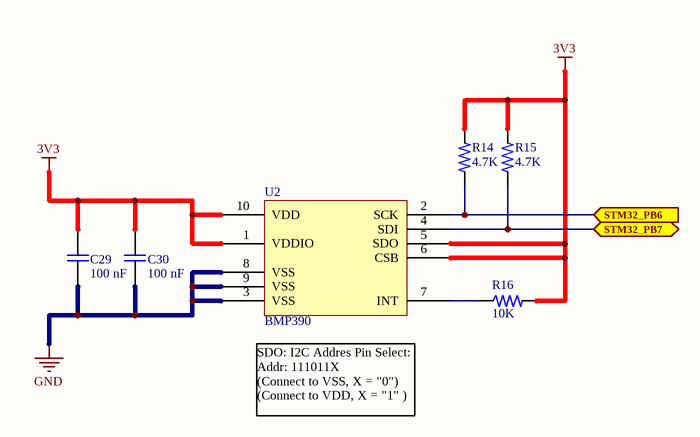
[diagram p4: PressureandTemperature.SchDoc]

### Parts
C29  100 nF  [MergenElektronik_Capacitors_Ceramics_SMDs_0603_M_NS]
C30  100 nF  [MergenElektronik_Capacitors_Ceramics_SMDs_0603_M_NS]
R14  4.7K  [MergenElektronik_Resistors_ChipResistors_0603_M_NS]
R15  4.7K  [MergenElektronik_Resistors_ChipResistors_0603_M_NS]
R16  10K  [MergenElektronik_Resistors_ChipResistors_0603_M_NS]
U2  BMP390  [MergenElektronik_Sensors_PressureSensors_10-WFLGA]

### Ports
STM32_PB6 (in, see Altimeter[3B], GPS[3B], Gyro[4B], Microcontroller[2C]), STM32_PB7 (bidir, see Altimeter[3B], GPS[3B], Gyro[4C], Microcontroller[2C])

### Nets
3V3: C29.1 C30.1 R14.2 R15.2 R16.2 U2.1(VDDIO) U2.5(SDO) U2.6(CSB) U2.10(VDD)
GND: C29.2 C30.2 U2.3(VSS) U2.8(VSS) U2.9(VSS)
NetR14_1: R14.1 U2.2(SCK) ; port STM32_PB6
NetR15_1: R15.1 U2.4(SDI) ; port STM32_PB7
NetR16_1: R16.1 U2.7(INT)

### Notes on the sheet
- (near U2) SDO: I2C Addres Pin Select:
  Addr: 111011X
  (Connect to VSS, X = "0")
  (Connect to VDD, X = "1" )
- Title:
- Size:
- Date:
- A4
- Number:
- Time:
- Revision:
- Sheet
- of
- Project
- Drawn By :

### Library data of the parts
C29 C30 = MergenElektronik_Capacitors_Ceramic_SMDs_100nF_100V: as C10 on sheet Microcontroller; Value: 100 nF; Temperature: -55°C up to +125°C; Digi-Key Number: 1276-6807-1-ND; Package: 0603(1608 Metric); Mouser Number: 187-CL10B104KC8NNNC; Mounting Type: Surface Mount; Farnell Number: 3013412; Özdisan Number: CL10B104KC8NNNC; Supplier 1: Digikey; Supplier 2: Mouser; Supplier Part Number 1: 1276-6807-1-ND; Supplier Part Number 2: 187-CL10B104KC8NNNC; Voltage Rating: 100V
R14 R15 = MergenElektronik_Resistors_ChipResistors_0603_4.7K: Mergen Elektronik - Resistors - Chip Resistors - 0603 - 4.7K; Manufacturer: Stackpole Electronics Inc; Manufacturer Number: RMCF0603FT4K70; Value: Chip Resistor - 0603 - 4.7K; Power: 1/10W; Tolerance: ±1%; Package: 0603(1608); Temperature: -55°C up to +155°C - X8R; Model: Chip Resistor; Digi-Key Number: RMCF0603FT4K70TR-ND; Mounting Type: Surface Mount; Mouser Number: 708-RMCF0603FT4K70; Supplier 1: Digikey; Supplier 2: Mouser; Supplier Part Number 1: RMCF0603FT4K70TR-ND; Supplier Part Number 2: 708-RMCF0603FT4K70
R16 = MergenElektronik_Resistors_ChipResistors_0603_10K: as R6 on sheet Microcontroller; Package: 0603(1608); Temperature: -55°C up to +155°C - X8R; Model: Chip Resistor; Digi-Key Number: RMCF0603JT10K0CT-ND; Mounting Type: Surface Mount; Supplier 1: Digi-Key; Supplier Part Number 1: RMCF0603JT10K0-ND
U2 = MergenElektronik_Sensors_PressureSensors_BMP390: Mergen Elektronik - Sensors - Pressure Sensors - BMP390; Manufacturer: Bosch Sensortec; Operating Pressure: 4.35PSI ~ 18.13PSI (30kPa ~ 125kPa); Operrating Supply Voltage: 1.65V up to 3.6V; Output Type: I2C, SPI; Tolerance: ±0.01PSI (0.05kPa); Digi-Key Number: 828-BMP390TR-ND; Model: Pressure Sensor; Manufacturer Number: BMP390; Mounting Type: Surface Mount; Mouser Number: 262-BMP390; Package: 10-WFLGA; Value: BMP390; Özdisan Number: BMP390; Temperature: -40°C up to 85°C (TA); Supplier 1: Digikey; Supplier Number 1: 828-BMP390TR-ND; Supplier 2: Mouser; Supplier Number 2: 262-BMP390

## Sheet Gyro.SchDoc: Gyro
size A4; SheetNumber: 9; SheetTotal: 13
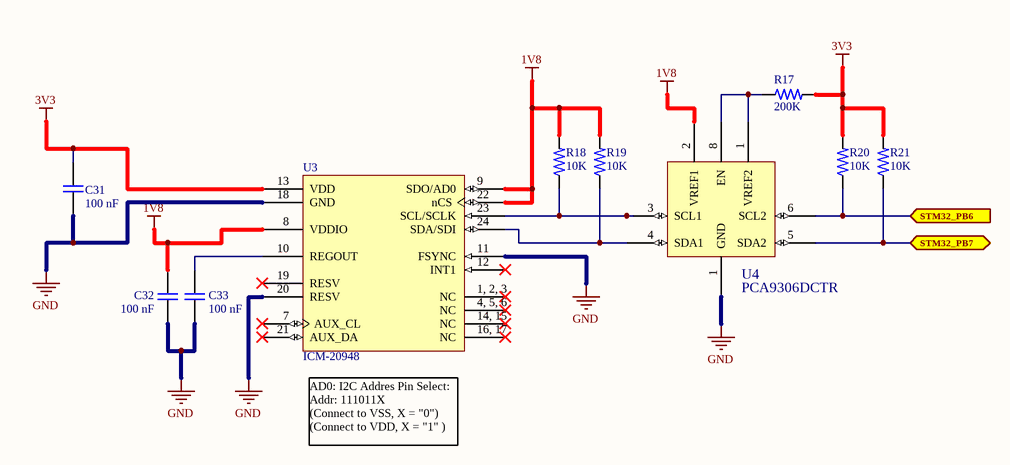
[diagram p5: Gyro.SchDoc]

### Parts
C31  100 nF  [MergenElektronik_Capacitors_Ceramics_SMDs_0603_M_NS]
C32  100 nF  [MergenElektronik_Capacitors_Ceramics_SMDs_0603_M_NS]
C33  100 nF  [MergenElektronik_Capacitors_Ceramics_SMDs_0603_M_NS]
R17  200K  [MergenElektronik_Resistors_ChipResistors_0603_M_NS]
R18  10K  [MergenElektronik_Resistors_ChipResistors_0603_M_NS]
R19  10K  [MergenElektronik_Resistors_ChipResistors_0603_M_NS]
R20  10K  [MergenElektronik_Resistors_ChipResistors_0603_M_NS]
R21  10K  [MergenElektronik_Resistors_ChipResistors_0603_M_NS]
U3  ICM-20948  [MergenElektronik_Sensors_Gyroscope-Accelerometer-Magnetometer_24-QFN]
U4  PCA9306DCTR  [MergenElektronik_Logics_LevelShifters_SSOP-8]

### Ports
STM32_PB6 (in, see Altimeter[3B], GPS[3B], Microcontroller[2C], PressureandTemperature[3B]), STM32_PB7 (bidir, see Altimeter[3B], GPS[3B], Microcontroller[2C], PressureandTemperature[3B])

### Nets
1V8: C32.1 R18.2 R19.2 U3.8(VDDIO) U3.9(SDO/AD0) U3.22(nCS) U4.2(VREF1)
3V3: C31.1 R17.2 R20.2 R21.2 U3.13(VDD)
GND: C31.2 C32.2 C33.2 U3.11(FSYNC) U3.18(GND) U3.20(RESV) U4.1(GND)
NetC33_1: C33.1 U3.10(REGOUT)
NetR14_1: R20.1 U4.6(SCL2) ; port STM32_PB6
NetR15_1: R21.1 U4.5(SDA2) ; port STM32_PB7
NetR17_1: R17.1 U4.1(VREF2) U4.8(EN)
NetR18_1: R18.1 U3.23(SCL/SCLK) U4.3(SCL1)
NetR19_1: R19.1 U3.24(SDA/SDI) U4.4(SDA1)

Not connected (* = marked no-connect by the designer): U3 1, 2, 3(NC)* 4, 5, 6(NC)* 7(AUX_CL)* 12(INT1)* 14, 15(NC)* 16, 17(NC)* 19(RESV)* 21(AUX_DA)*

### Notes on the sheet
- (near U3) AD0: I2C Addres Pin Select:
  Addr: 111011X
  (Connect to VSS, X = "0")
  (Connect to VDD, X = "1" )
- Title:
- Size:
- Date:
- A4
- Number:
- Time:
- Revision:
- Sheet
- of
- Project
- Drawn By :

### Library data of the parts
C31-C33 = MergenElektronik_Capacitors_Ceramic_SMDs_100nF_100V: as C10 on sheet Microcontroller; Value: 100 nF; Temperature: -55°C up to +125°C; Digi-Key Number: 1276-6807-1-ND; Package: 0603(1608 Metric); Mouser Number: 187-CL10B104KC8NNNC; Mounting Type: Surface Mount; Farnell Number: 3013412; Özdisan Number: CL10B104KC8NNNC; Supplier 1: Digikey; Supplier 2: Mouser; Supplier Part Number 1: 1276-6807-1-ND; Supplier Part Number 2: 187-CL10B104KC8NNNC; Voltage Rating: 100V
R17 = MergenElektronik_Resistors_ChipResistors_0603_200K: Mergen Elektronik - Resistors - Chip Resistors - 0603 - 200K; Manufacturer: Stackpole Electronics Inc; Manufacturer Number: RMCF0603FT200K; Value: Chip Resistor - 0603 - 200K; Power: 1/10W; Tolerance: ±1%; Package: 0603(1608); Temperature: -55°C up to +155°C - X8R; Model: Chip Resistor; Digi-Key Number: RMCF0603FT200KTR-ND; Mounting Type: Surface Mount; Mouser Number: 708-RMCF0603FT200K; Supplier 1: Digikey; Supplier 2: Mouser; Supplier Part Number 1: RMCF0603FT200KTR-ND; Supplier Part Number 2: 708-RMCF0603FT200K
R18-R21 = MergenElektronik_Resistors_ChipResistors_0603_10K: as R6 on sheet Microcontroller; Package: 0603(1608); Temperature: -55°C up to +155°C - X8R; Model: Chip Resistor; Digi-Key Number: RMCF0603JT10K0CT-ND; Mounting Type: Surface Mount; Supplier 1: Digi-Key; Supplier Part Number 1: RMCF0603JT10K0-ND
U3 = MergenElektronik_Sensors_Gyroscope-Accelerometer-Magnetometer_ICM-20948: Mergen Elektronik - Sensors - Gytoscope - Accelometer - Magnetometer - ICM-20948; Manufacturer: TDK InvenSense; Model: Gyroscope-Accelerometer-Magnetometer Sensor; Operating Supply Voltage: 1.7VDC up to 3.6VDC; Output Type: I2C, SPI; Digi-Key Number: 1428-1123-2-ND; Manufacturer Number: ICM-20948; Mounting Type: Surface Mount; Mouser Number: 410-ICM-20948; Farnell Number: 2911498; Özdisan Number: ICM-20948; Package: 24-QFN; Temperature: -40°C up to 85°C; Supplier 1: Digi-Key; Supplier Number 1: 1428-1123-2-ND; Supplier 2: Mouser; Supplier Number 2: 410-ICM-20948
U4 = MergenElektronik_Logics_LevelShifters_PCA9306DCTR: Mergen Elektronik - Logics - Level Shifters - PCA9306DCTR; Manufacturer: Texas Instruments; Outpu Type: Open Drain, Push-Pull; Circuit Channels: 2; Voltage Rating: 1.2V up to 5.5V; Digi-Key Number: 296-18509-2-ND; Manufacturer Number: PCA9306DCTR; Model: Level Shifters; Mounting Type: Surface Mount; Mouser Number: 595-PCA9306DCTR; Package: SSOP-8; Temperature: -40°C up to +105°C; Value: PCA9306DCTR; Farnell Number: 3120911; Supplier 1: Digi-Key; Supplier 2: Mouser; Supplier Part Number 2: 595-PCA9306DCTR; Features: Auto-Direction Sensing; Applications: I2C, UART , SMBUS, PMBUS, Two Signal Interfaces; Supplier Part Number 1: 296-18509-2-ND

## Sheet GPS.SchDoc: GPS
size A4; SheetNumber: 7; SheetTotal: 13
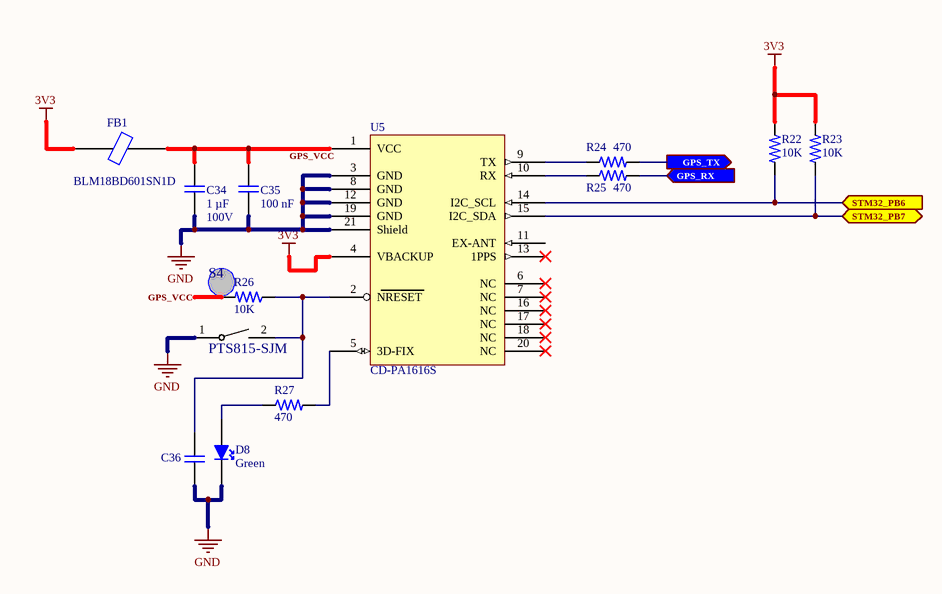
[diagram p6: GPS.SchDoc]

### Parts
C34  1 µF  Voltage Rating: 100V  [MergenElektronik_Capacitors_Ceramics_SMDs_1206_M_NS]
C35  100 nF  [MergenElektronik_Capacitors_Ceramics_SMDs_0603_M_NS]
C36  100 nF  [MergenElektronik_Capacitors_Ceramics_SMDs_0603_M_NS]  (value not drawn)
D8  Green  [MergenElektronik_Leds_SMDs_0603_M_NS]
FB1  BLM18BD601SN1D  [MergenElektronik_Filters_FerriteBeads_0603_M_NS]
R22  10K  [MergenElektronik_Resistors_ChipResistors_0603_M_NS]
R23  10K  [MergenElektronik_Resistors_ChipResistors_0603_M_NS]
R24  470  [MergenElektronik_Resistors_ChipResistors_0603_M_NS]
R25  470  [MergenElektronik_Resistors_ChipResistors_0603_M_NS]
R26  10K  [MergenElektronik_Resistors_ChipResistors_0603_M_NS]
R27  470  [MergenElektronik_Resistors_ChipResistors_0603_M_NS]
S4  PTS815-SJM  [MergenElektronik_Switches_TactileSwitches_PTS815]
U5  CD-PA1616S  [MergenElektronik_Modules_GPS_CD-PA1616S]

### Ports
GPS_RX (in, see Microcontroller[4B]), GPS_TX (out, see Microcontroller[3B]), STM32_PB6 (in, see Altimeter[3B], Gyro[4B], Microcontroller[2C], PressureandTemperature[3B]), STM32_PB7 (bidir, see Altimeter[3B], Gyro[4C], Microcontroller[2C], PressureandTemperature[3B])

### Nets
3V3: FB1.1 R22.1 R23.1 U5.4(VBACKUP)
GND: C34.2 C35.2 C36.2 D8.2(KATOT) S4.1 U5.3(GND) U5.8(GND) U5.12(GND) U5.19(GND) U5.21(Shield)
GPS_VCC: C34.1 C35.1 FB1.2 R26.2 U5.1(VCC)
NetC36_1: C36.1 R26.1 S4.2 U5.2(NRESET)
NetD8_1: D8.1(ANOT) R27.1
NetJ1_1: R24.2 ; port GPS_TX
NetJ1_4: R25.2 ; port GPS_RX
NetR14_1: R22.2 U5.14(I2C_SCL) ; port STM32_PB6
NetR15_1: R23.2 U5.15(I2C_SDA) ; port STM32_PB7
NetR24_1: R24.1 U5.9(TX)
NetR25_1: R25.1 U5.10(RX)
NetR27_2: R27.2 U5.5(3D-FIX)

Not connected (* = marked no-connect by the designer): U5 6(NC)* 7(NC)* 11(EX-ANT) 13(1PPS)* 16(NC)* 17(NC)* 18(NC)* 20(NC)*

### Notes on the sheet
- Title:
- Size:
- Date:
- A4
- Number:
- Time:
- Revision:
- Sheet
- of
- Project
- Drawn By :

### Library data of the parts
C34 = MergenElektronik_Capacitors_Ceramic_SMDs_1µF_100V: as C3 on sheet Power; Value: 1 µF; Temperature: -55°C up to +125°C; Digi-Key Number: 1276-1838-1-ND; Package: 1206(3216 Metric); Mouser Number: 187-CL31B105KCHNNNE; Mounting Type: Surface Mount; Özdisan Number: CL31B105KCHNNNE; Supplier 1: Digikey; Supplier 2: Mouser; Supplier Part Number 1: 1276-1838-1-ND; Supplier Part Number 2: 187-CL31B105KCHNNNE
C35 C36 = MergenElektronik_Capacitors_Ceramic_SMDs_100nF_100V: as C10 on sheet Microcontroller; Value: 100 nF; Temperature: -55°C up to +125°C; Digi-Key Number: 1276-6807-1-ND; Package: 0603(1608 Metric); Mouser Number: 187-CL10B104KC8NNNC; Mounting Type: Surface Mount; Farnell Number: 3013412; Özdisan Number: CL10B104KC8NNNC; Supplier 1: Digikey; Supplier 2: Mouser; Supplier Part Number 1: 1276-6807-1-ND; Supplier Part Number 2: 187-CL10B104KC8NNNC; Voltage Rating: 100V
D8 = MergenElektronik_LEDs_SMDs_Green_0603: Mergen Elektronik - Leds - SMDs - Green - 0603; Manufacturer: Würth Elektronik; Manufacturer Number: 150060GS75000; Model: SMD Leds; Voltage Rating: 3.2V; Value: Green; Temperature: -45°C up to +85°C; Digi-Key Number: 732-4971-1-ND; Package: 0603(1608); Farnell Number: 2322070; Mouser Number: 710-150060GS75000; Mounting Type: Surface Mount; Color: Green; Özdisan Number: 150060GS75000; Supplier 1: Digi-Key; Supplier 2: Mouser; Supplier Part Number 1: 732-4971-6-ND; Supplier Part Number 2: 710-150060GS75000
FB1 = MergenElektronik_Filters_FerriteBeads_BLM18BD601SN1D: Mergen Elektronik - Filters - Ferrite Beads - BLM18BD601SN1D; Manufacturer: Murata Electronics; Impedance @ Frequency: 600 Ohms @ 100 MHz; Current Rating: 200mA; DC Resistance: 650mOhm; Manufacturer Number: BLM18BD601SN1D; Mounting Type: Surface Mount; Package: 0603(1608 Metric); Temperature: -55°C up to 125°C; Digi-Key Number: 490-1023-2-ND; Farnell Number: 1515713; Mouser Number: 81-BLM11B601S; Supplier 1: Digi-Key; Supplier 2: Mouser; Supplier Part Number 1: 490-1023-2-ND; Supplier Part Number 2: 81-BLM11B601S
R22 R23 R26 = MergenElektronik_Resistors_ChipResistors_0603_10K: as R6 on sheet Microcontroller; Package: 0603(1608); Temperature: -55°C up to +155°C - X8R; Model: Chip Resistor; Digi-Key Number: RMCF0603JT10K0CT-ND; Mounting Type: Surface Mount; Supplier 1: Digi-Key; Supplier Part Number 1: RMCF0603JT10K0-ND
R24 R25 R27 = MergenElektronik_Resistors_ChipResistors_0603_470: Mergen Elektronik - Resistors - Chip Resistors - 0603 - 470; Manufacturer: Stackpole Electronics Inc; Manufacturer Number: RMCF0603JT470R; Value: Chip Resistor - 0603 - 470; Power: 1/10W; Tolerance: ±5%; Package: 0603(1608); Temperature: -55°C up to +155°C - X8R; Model: Chip Resistor; Digi-Key Number: RMCF0603JT470RTR-ND; Mounting Type: Surface Mount; Mouser Number: 708-RMCF0603JT470R; Supplier 1: Digikey; Supplier 2: Mouser; Supplier Part Number 2: 708-RMCF0603JT470R; Supplier Part Number 1: RMCF0603JT470RTR-ND
S4 = MergenElektronik_Switches_TactileSwitches_PTS815-SJM: as S1 on sheet Microcontroller; Digi-Key Number: CKN12215-1-ND; Model: Tactile Switches; Mounting Type: Surface Mount; Package: PTS815; Temperature: -20°C up to +70°C; Value: PTS815-SJM; Mouser Number: 611-PTS815SJM250SMTR; Farnell Number: 3780619; Supplier 1: Mouser; Supplier 2: Digi-Key; Supplier Part Number 1: 611-PTS815SJM250SMTR; Supplier Part Number 2: CKN12215-6-ND
U5 = MergenElektronik_Modules_GPS: Mergen Elektronik -  Modules - GPS - CD-PA1616S; Manufacturer: Adafruit; Manufacturer Number: 790; Model: GPS Module; Update Rate: 1Hz up to 10 Hz; Tolerance: < 3 meters; Operating Supply Voltage: 3.0 up to 5.5VDC; Package: CD-PA1616S; Temperature: -40 °C  up to +85 °C; Mounting Type: Surface Mount; Value: CD-PA1616S

## Sheet Altimeter.SchDoc: Altimeter
size A4; SheetNumber: 10; SheetTotal: 13
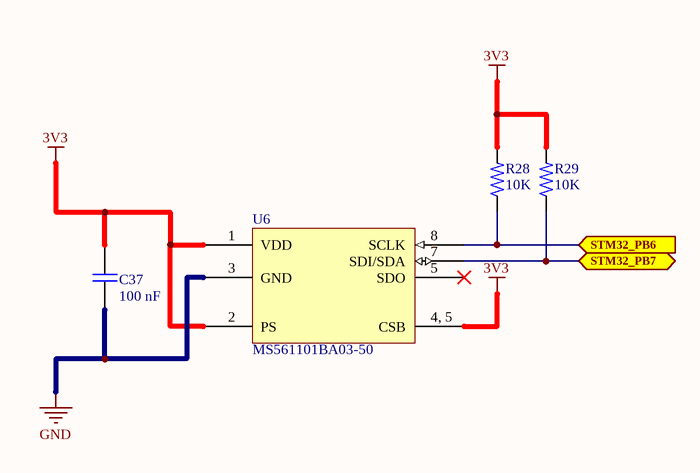
[diagram p7: Altimeter.SchDoc]

### Parts
C37  100 nF  [MergenElektronik_Capacitors_Ceramics_SMDs_0603_M_NS]
R28  10K  [MergenElektronik_Resistors_ChipResistors_0603_M_NS]
R29  10K  [MergenElektronik_Resistors_ChipResistors_0603_M_NS]
U6  MS561101BA03-50  [MergenElektronik_Sensors_AltimeterSensors_MS561101BA03-50]

### Ports
STM32_PB6 (in, see GPS[3B], Gyro[4B], Microcontroller[2C], PressureandTemperature[3B]), STM32_PB7 (bidir, see GPS[3B], Gyro[4C], Microcontroller[2C], PressureandTemperature[3B])

### Nets
3V3: C37.1 R28.2 R29.2 U6.1(VDD) U6.2(PS) U6.4,_5(CSB)
GND: C37.2 U6.3(GND)
NetR14_1: R28.1 U6.8(SCLK) ; port STM32_PB6
NetR15_1: R29.1 U6.7(SDI/SDA) ; port STM32_PB7

Not connected (* = marked no-connect by the designer): U6 5(SDO)*

### Notes on the sheet
- Title:
- Size:
- Date:
- A4
- Number:
- Time:
- Revision:
- Sheet
- of
- Project
- Drawn By :

### Library data of the parts
C37 = MergenElektronik_Capacitors_Ceramic_SMDs_100nF_100V: as C10 on sheet Microcontroller; Value: 100 nF; Temperature: -55°C up to +125°C; Digi-Key Number: 1276-6807-1-ND; Package: 0603(1608 Metric); Mouser Number: 187-CL10B104KC8NNNC; Mounting Type: Surface Mount; Farnell Number: 3013412; Özdisan Number: CL10B104KC8NNNC; Supplier 1: Digikey; Supplier 2: Mouser; Supplier Part Number 1: 1276-6807-1-ND; Supplier Part Number 2: 187-CL10B104KC8NNNC; Voltage Rating: 100V
R28 R29 = MergenElektronik_Resistors_ChipResistors_0603_10K: as R6 on sheet Microcontroller; Package: 0603(1608); Temperature: -55°C up to +155°C - X8R; Model: Chip Resistor; Digi-Key Number: RMCF0603JT10K0CT-ND; Mounting Type: Surface Mount; Supplier 1: Digi-Key; Supplier Part Number 1: RMCF0603JT10K0-ND
U6 = MergenElektronik_Sensors_AltimeterSensors_MS561101BA03-50: Mergen Elektronik - Sensors - Altimeter Sensors - MS561101BA03-50; Manufacturer: TE Connectivity Measurement Specialties; Operating Supply Voltage: 1.8V up to 3.6V; Output Type: I2C, SPI; Operating Pressure: 0.15PSI up to 17.4PSI (1kPa up to 120kPa); Tolerance: ±0.022PSI (±0.15kPa); Value: MS561101BA03-50; Model: Altimeter Sensor; Temperature: -40°C up to 85°C; Mounting Type: Surface Mount; Package: MS561101BA03-50; Digi-Key Number: 223-1622-2-NDv; Mouser Number: 824-MS561101BA03-50; Farnell Number: 2362662; Özdisan Number: MS561101BA03-50; Supplier 1: Digi-Key; Supplier Part Number 1: 223-1622-2-NDv; Supplier 2: Mouser; Supplier Part Number 2: 824-MS561101BA03-50; Manufacturer Number: MS561101BA03-50

## Sheet LoRa.SchDoc: LoRa
size A4; SheetNumber: 6; SheetTotal: 13
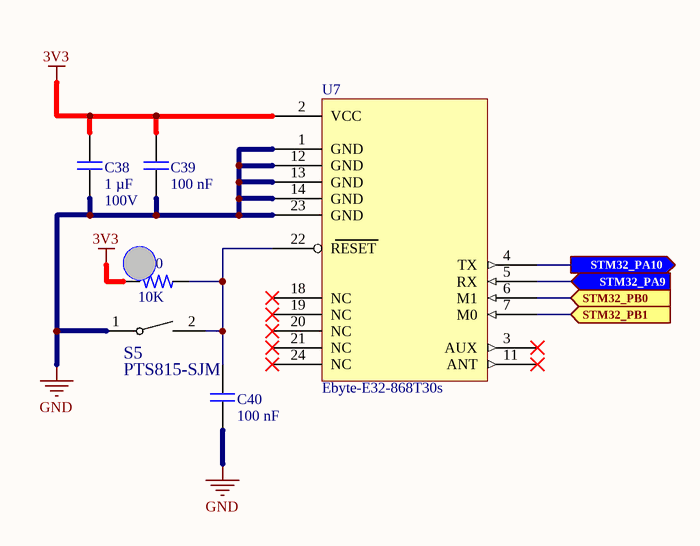
[diagram p8: LoRa.SchDoc]

### Parts
C38  1 µF  Voltage Rating: 100V  [MergenElektronik_Capacitors_Ceramics_SMDs_1206_M_NS]
C39  100 nF  [MergenElektronik_Capacitors_Ceramics_SMDs_0603_M_NS]
C40  100 nF  [MergenElektronik_Capacitors_Ceramics_SMDs_0603_M_NS]
R30  10K  [MergenElektronik_Resistors_ChipResistors_0603_M_NS]
S5  PTS815-SJM  [MergenElektronik_Switches_TactileSwitches_PTS815]
U7  Ebyte-E32-868T30s  [MergenElektronik_Modules_LoRas_Ebyte-E32-xxxxT30x]

### Ports
STM32_PA9 (in, see Microcontroller[2C]), STM32_PA10 (out, see Microcontroller[2C]), STM32_PB0 (in, see Microcontroller[3C]), STM32_PB1 (in, see Microcontroller[3C])

### Nets
3V3: C38.1 C39.1 R30.1 U7.2(VCC)
GND: C38.2 C39.2 C40.2 S5.1 U7.1(GND) U7.12(GND) U7.13(GND) U7.14(GND) U7.23(GND)
NetC40_1: C40.1 R30.2 S5.2 U7.22(RESET)
NetU1_18: U7.6(M1) ; port STM32_PB0
NetU1_19: U7.7(M0) ; port STM32_PB1
NetU1_30: U7.5(RX) ; port STM32_PA9
NetU1_31: U7.4(TX) ; port STM32_PA10

Not connected (* = marked no-connect by the designer): U7 3(AUX)* 11(ANT)* 18(NC)* 19(NC)* 20(NC)* 21(NC)* 24(NC)*

### Notes on the sheet
- Title:
- Size:
- Date:
- A4
- Number:
- Time:
- Revision:
- Sheet
- of
- Project
- Drawn By :

### Library data of the parts
C38 = MergenElektronik_Capacitors_Ceramic_SMDs_1µF_100V: as C3 on sheet Power; Value: 1 µF; Temperature: -55°C up to +125°C; Digi-Key Number: 1276-1838-1-ND; Package: 1206(3216 Metric); Mouser Number: 187-CL31B105KCHNNNE; Mounting Type: Surface Mount; Özdisan Number: CL31B105KCHNNNE; Supplier 1: Digikey; Supplier 2: Mouser; Supplier Part Number 1: 1276-1838-1-ND; Supplier Part Number 2: 187-CL31B105KCHNNNE
C39 C40 = MergenElektronik_Capacitors_Ceramic_SMDs_100nF_100V: as C10 on sheet Microcontroller; Value: 100 nF; Temperature: -55°C up to +125°C; Digi-Key Number: 1276-6807-1-ND; Package: 0603(1608 Metric); Mouser Number: 187-CL10B104KC8NNNC; Mounting Type: Surface Mount; Farnell Number: 3013412; Özdisan Number: CL10B104KC8NNNC; Supplier 1: Digikey; Supplier 2: Mouser; Supplier Part Number 1: 1276-6807-1-ND; Supplier Part Number 2: 187-CL10B104KC8NNNC; Voltage Rating: 100V
R30 = MergenElektronik_Resistors_ChipResistors_0603_10K: as R6 on sheet Microcontroller; Package: 0603(1608); Temperature: -55°C up to +155°C - X8R; Model: Chip Resistor; Digi-Key Number: RMCF0603JT10K0CT-ND; Mounting Type: Surface Mount; Supplier 1: Digi-Key; Supplier Part Number 1: RMCF0603JT10K0-ND
S5 = MergenElektronik_Switches_TactileSwitches_PTS815-SJM: as S1 on sheet Microcontroller; Digi-Key Number: CKN12215-1-ND; Model: Tactile Switches; Mounting Type: Surface Mount; Package: PTS815; Temperature: -20°C up to +70°C; Value: PTS815-SJM; Mouser Number: 611-PTS815SJM250SMTR; Farnell Number: 3780619; Supplier 1: Mouser; Supplier 2: Digi-Key; Supplier Part Number 1: 611-PTS815SJM250SMTR; Supplier Part Number 2: CKN12215-6-ND
U7 = MergenElektronik_Modules_LoRas_Ebyte-E32-868T30s: Mergen Elektronik - Modules - LoRas - Ebyte-E32-868T30s; Manufacturer: Ebyte; Distance: 8 km; Interface: UART; Power: 30dBm; Frequency: 862-893MHz; IC: SX1276; Manufacturer Number: E32-868T30s